# EAGLE design Gvove - Piezo Vibration Sensor v1.1 (EAGLE 6.5.0)

## Sheet 1 of 2
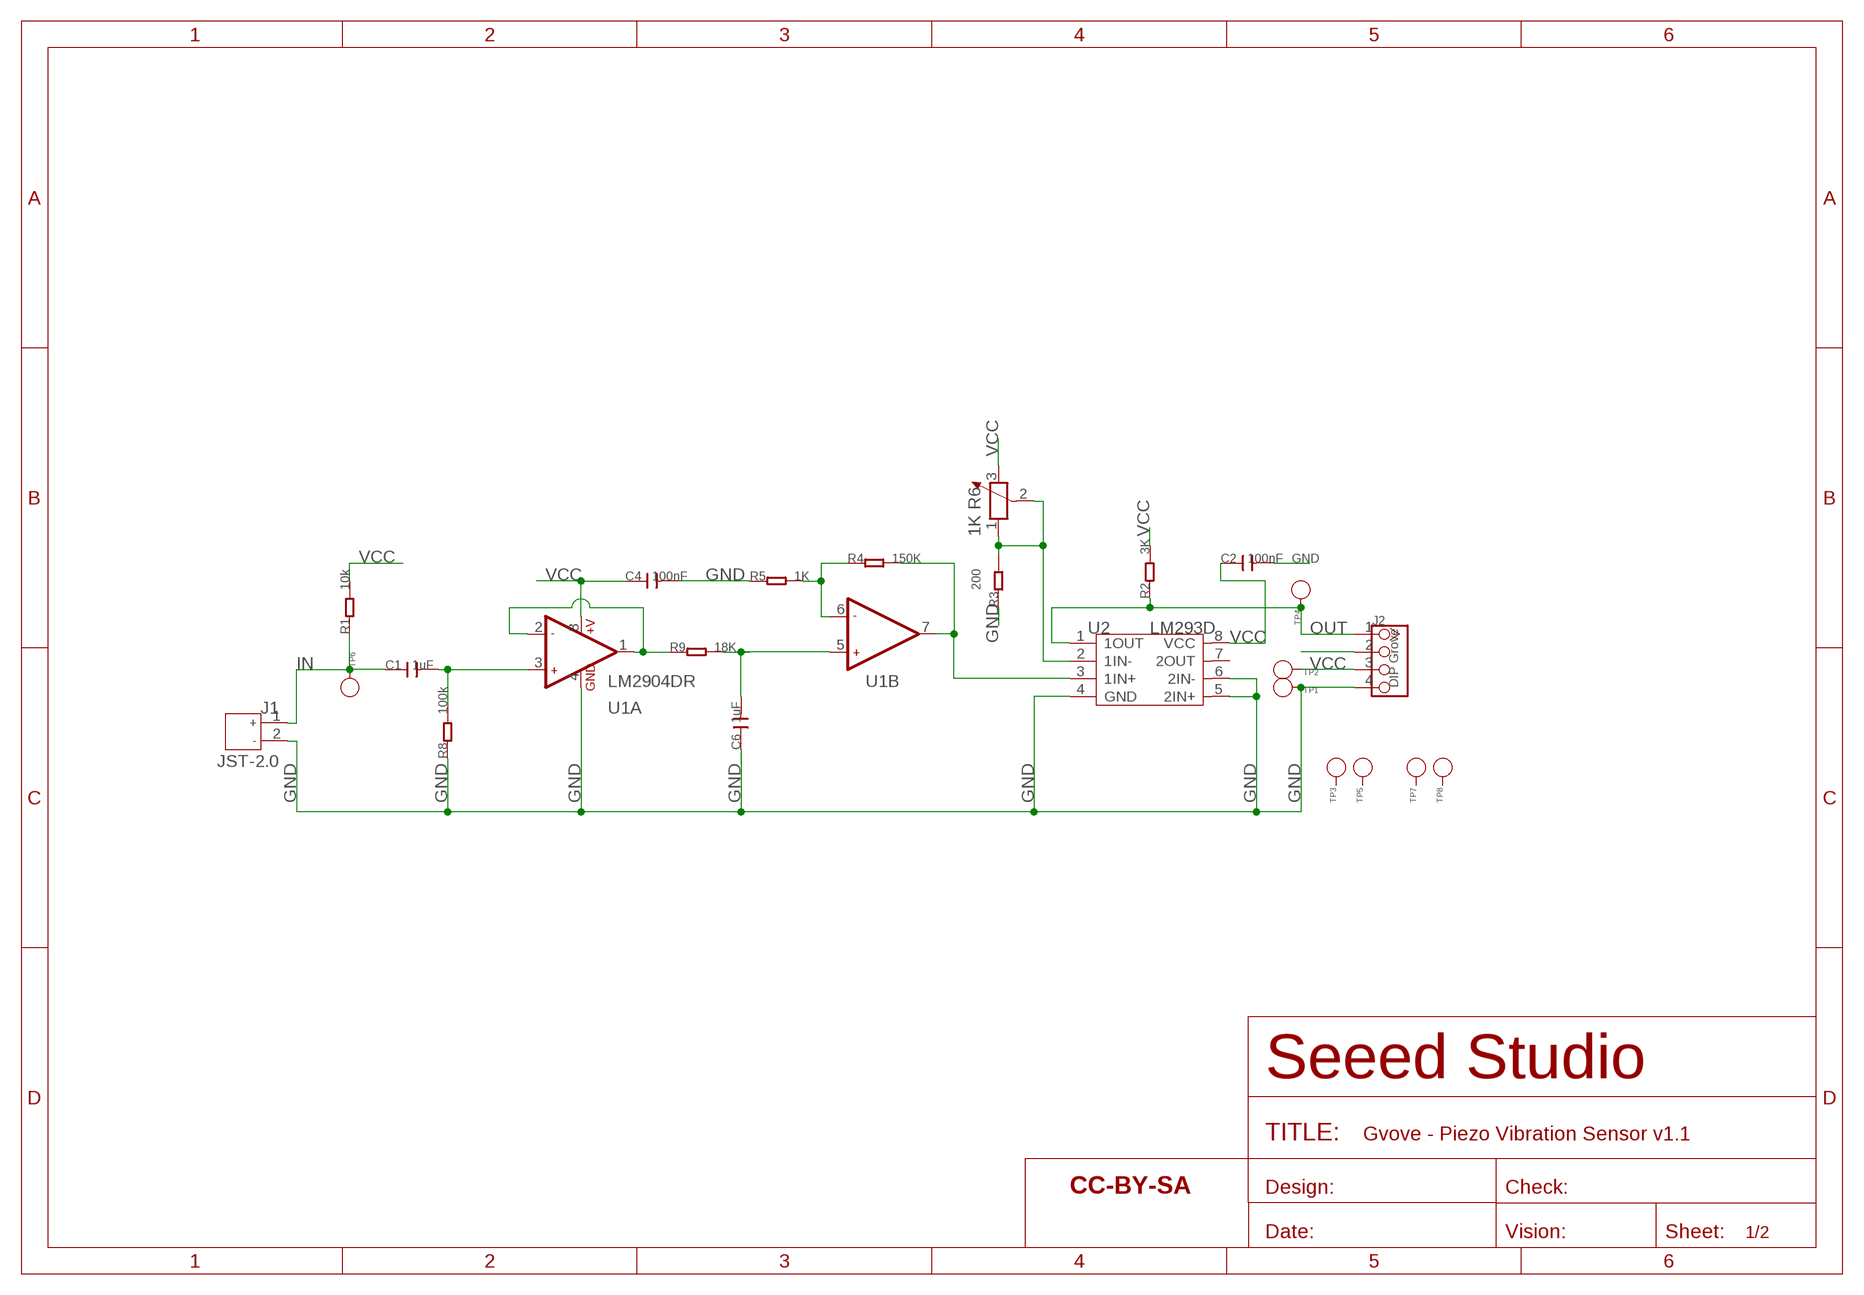
[diagram p0: schematic, sheet 1]

### Parts
C1  1uF  C-0603  [C0603]
C2  100nF  C-0603  [C0603]
C4  100nF  C-0603  [C0603]
C6  1uF  C-0603  [C0603]
J1  JST-2.0  JACK-JST-2P-PW'2.0'  [JST-2.0]
J2  DIP Grove  TWIG-4P-2.0-2.0  [4P-2.0]
R1  10k  R-0603  [R0603]
R2  3K  R-0603  [R0603]
R3  200  R-0603  [R0603]
R4  150K  R-0603  [R0603]
R5  1K  R-0603  [R0603]
R6  1K  R-POTENTIOMETER'RTRIM3214W'  [3P-SMD-SQUA-4.6X3.7]
R8  100k  R-0603  [R0603]
R9  18K  R-0603  [R0603]
TP1  PAD-TEST-POINT'4545'  [TP_4545]
TP2  PAD-TEST-POINT'4545'  [TP_4545]
TP3  PAD-TEST-POINT'4545'  [TP_4545]
TP4  PAD-TEST-POINT'4545'  [TP_4545]
TP5  PAD-TEST-POINT'4545'  [TP_4545]
TP6  PAD-TEST-POINT'4545'  [TP_4545]
TP7  PAD-TEST-POINT'4545'  [TP_4545]
TP8  PAD-TEST-POINT'4545'  [TP_4545]
U1  LM2904DR  LMV358D  [SO08]
U2  LM293D  [SOIC8-6.0]
U$2  SEEEDSTUDIO-OPEN-SCH-FRAME  [SEEEDSTUDIO-PCB-FRAME]

### Nets
GND: C2.2 C4.2 C6.1 J1.2 J2.4 R3.1 R5.1 R8.1 TP1.T U1.4(A:GND) U2.4(GND) U2.5(2IN+) U2.6(2IN-)
IN: C1.1 J1.1 R1.1 TP6.T
N$1: R3.2 R6.1 R6.2 U2.2(1IN-)
N$2: C1.2 R8.2 U1.3(A:+IN1)
N$3: R9.1 U1.1(A:OUT1) U1.2(A:-IN1)
N$4: R4.1 R5.2 U1.6(B:-IN2)
N$5: R4.2 U1.7(B:OUT2) U2.3(1IN+)
N$6: J2.2
N$9: C6.2 R9.2 U1.5(B:+IN2)
OUT: J2.1 R2.1 TP4.T U2.1(1OUT)
VCC: C2.1 C4.1 J2.3 R1.2 R2.2 R6.3 TP2.T U1.8(A:+V) U2.8(VCC)
Unconnected: TP3.T TP5.T TP7.T TP8.T U2.7(2OUT)

## Sheet 2 of 2
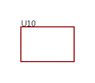
[diagram p1: schematic, sheet 2]

### Parts
U10  TWIG'2U'  [GROVE-TEST-PLATFORM]

## Library data of the parts
C1 C2 C4 C6 = Discrete:C*: Ceramic Capacitors
J1 = Connector:JACK-JST-2P-PW
J2 = Connector:TWIG-4P-2.0
R1-R5 R8 R9 = Discrete:R*
R6 = Discrete:R-POTENTIOMETER*: Potentiometer
TP1-TP8 = Discrete:PAD-TEST-POINT; PARTNO: DNP
U1 = IC:LMV358: General purpose LOW Voltage, Rail-to-Rail Output Amplifiers http://www.fairchildsemi.com/ds/LM/LMV358.pdf
U2 = template:LM293: Dual Differential Comparator
U10 = template:TWIG
U$2 = moudle-new:SEEEDSTUDIO-OPEN-SCH-FRAME

## Board
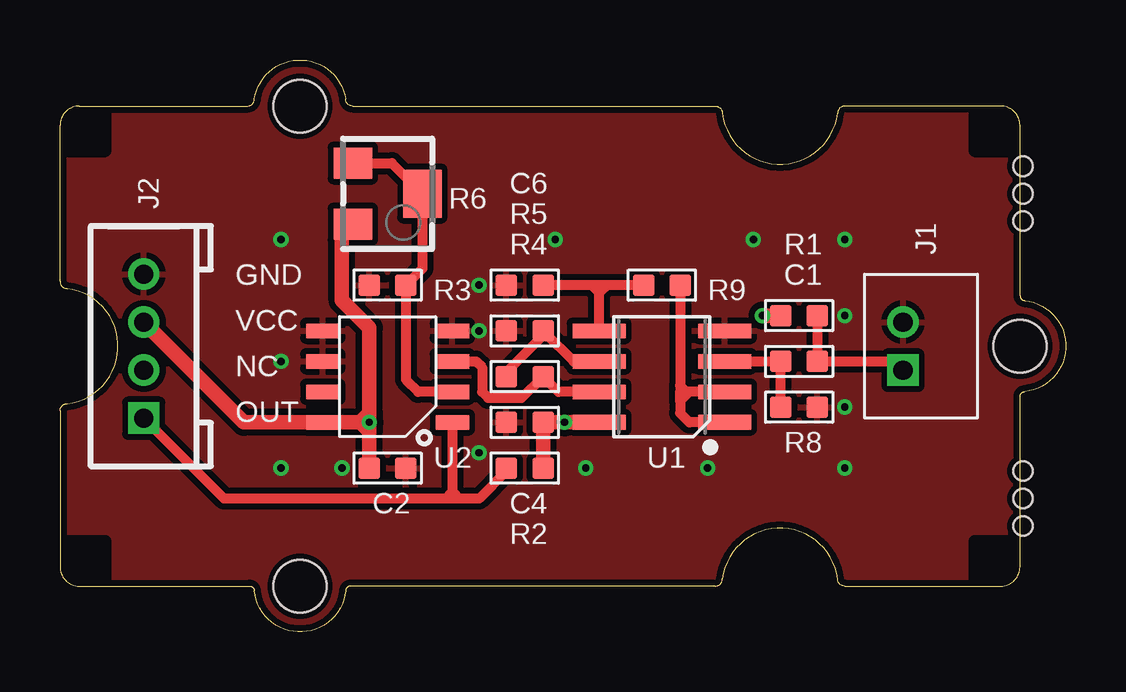
[diagram p2: board, top side]
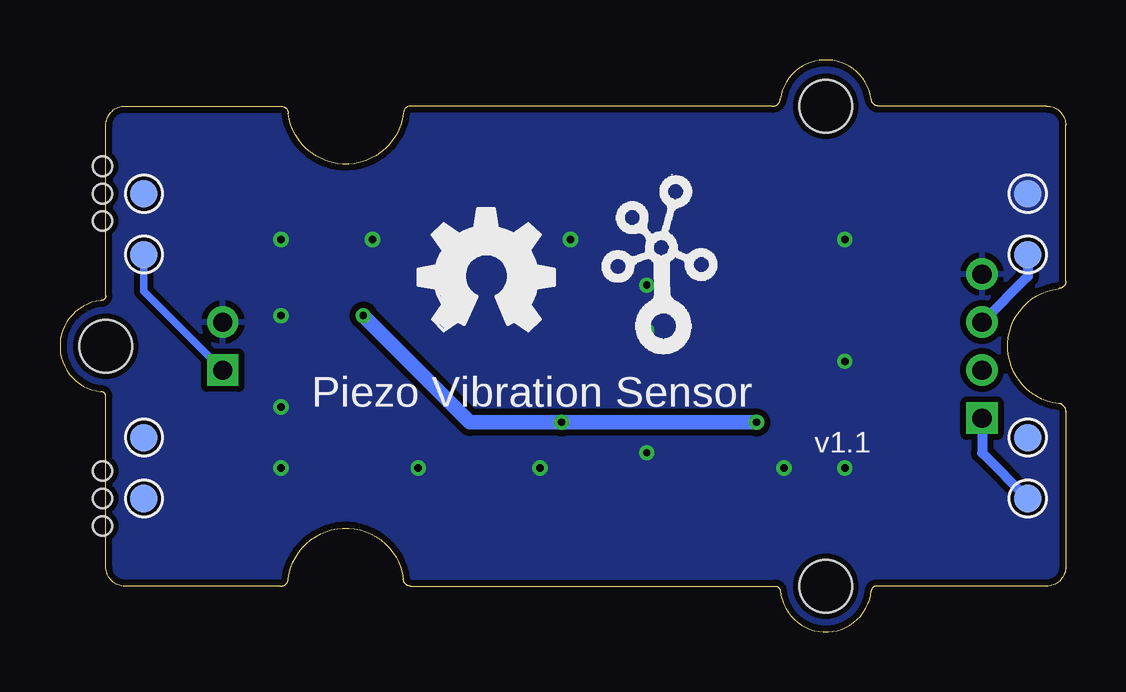
[diagram p3: board, bottom side, seen from below]

Size 41.91 x 23.83 mm. Coordinates in mm from the lower left corner, seen from the top.
Copper layers (1*16): Top 0.035mm / dielectric 1.5mm / Bottom 0.035mm
Design rules "SeeedStudio_2layer_DRU_no_angle_20140221 *": minimum track width 6mil, minimum drill 12mil, track to track 6mil, track to pad 6mil, pad to pad 6mil, via to via 6mil, smd to smd 0mil, copper to edge 10mil, drill to drill 10mil, minimum pad ring 10mil, minimum via ring 6mil, stop-mask expansion 2mil, vias tented up to drill 100mil, thermal gap 10mil
Holes 0.8 mm at 40.13,17.12 40.13,19.4 40.13,18.26 40.13,4.42 40.13,6.7 40.13,5.56

### Footprints (pad centres in the part's own frame; a part is rotated, then mirrored left to right if it is on the bottom)
C0603 = smd 0.889 x 0.889: 1 -0.762,0; 2 0.762,0
JST-2.0 = drill 0.8 pad 1.3 square: 1 -1,0.75 | drill 0.8 pad 1.3: 2 1,0.75
4P-2.0 = drill 0.8 pad 1.27 square: 1 -3,0 | drill 0.8 pad 1.27: 2 -1,0; 3 1,0; 4 3,0
R0603 = smd 0.889 x 0.889: 1 -0.762,0; 2 0.762,0
3P-SMD-SQUA-4.6X3.7 = smd 1.3 x 1.6: 1 -1.275,-1.45; 3 1.275,-1.45 | smd 2 x 1.6: 2 0,1.45
TP_4545 = smd 1.143 x 1.143: T 0,0
SO08 = smd 0.61 x 2.21: 1 -1.905,-2.616; 2 -0.635,-2.616; 3 0.635,-2.616; 4 1.905,-2.616; 5 1.905,2.616; 6 0.635,2.616; 7 -0.635,2.616; 8 -1.905,2.616
SOIC8-6.0 = smd 0.6 x 1.4: 1 -1.905,-2.7; 2 -0.635,-2.7; 3 0.635,-2.7; 4 1.905,-2.7; 5 1.905,2.7; 6 0.635,2.7; 7 -0.635,2.7; 8 -1.905,2.7
GROVE-TEST-PLATFORM = hole 2.2: -10,-10; -10,10; 20,0

### Placement (x,y rotation side)
C1  30.8,11.27 180 top
C2  13.65,6.83 0 top
C4  19.36,8.73 180 top
C6  19.36,14.45 0 top
J1  35.88,11.91 90 top
J2  3.49,11.91 90 top
R1  30.8,13.18 180 top
R2  19.36,6.83 0 top
R3  13.65,14.45 0 top
R4  19.36,10.64 0 top
R5  19.36,12.54 0 top
R6  13.65,18.26 270 top
R8  30.8,9.37 180 top
R9  25.08,14.45 180 top
TP1  1.59,18.26 0 bottom
TP2  1.59,15.72 0 bottom
TP3  1.59,8.1 0 bottom
TP4  1.59,5.56 0 bottom
TP5  38.41,5.56 0 bottom
TP6  38.41,15.72 0 bottom
TP7  38.41,18.26 0 bottom
TP8  38.41,8.1 0 bottom
U1  25.08,10.64 90 top
U2  13.65,10.64 90 top
U10  20,11.91 0 top
U$1  [GROVE-TEST-PLATFORM]  20,11.91 0 top
U$2  -0.34,-10.06 0 top  (outside the outline)
U$3  [TWIGLOGO]  16.82,12.54 0 bottom
U$4  [OSHW_FILLX200_NOTEXT]  26.98,12.54 0 bottom

### Tracks (layer width: path | path; a pad name or v marks a point on that pad's centre or on a via)
GND  (via drill 0.3 pad 0.64)
  other vias: 9.21,11.27 9.21,6.83 11.74,6.83 17.46,7.46 32.7,9.37 17.46,14.45 17.46,12.54 9.21,16.35 20.64,16.35 28.89,16.35 32.7,13.18 32.7,16.35 21.91,6.83 26.98,6.83 32.7,6.83
  pour Top (isolate 0.254): -0.32,23.97 42.23,23.97 42.23,-0.16 -0.32,-0.16
  pour Bottom (isolate 0.254): -0.32,23.97 42.23,23.97 42.23,-0.16 -0.32,-0.16
IN
  Top 0.406: R1.1 C1.1 34.76,11.27 J1.1
  Bottom 0.305: TP6.T 38.41,14.2 J1.1
N$1
  Top 0.406: U2.2 14.92,10 14.41,10.51 R3.2 15.1,15.14 R6.2 13.82,19.53 R6.1
N$2
  Top 0.406: R8.2 30.03,11.02 | 30.03,11.02 C1.2 30.16,11.4 | U1.3 29.78,11.27 30.03,11.02
N$3
  Top 0.406: R9.1 25.84,10.26 | 25.84,10.26 25.84,10 | 25.84,9.62 25.84,9.11 26.22,8.73 U1.1 | U1.2 26.22,10 | 26.1,10 25.84,10 | 26.22,10 26.1,10 | 26.1,10 25.84,10.26 | 26.22,10 25.84,9.62 | 25.84,9.62 25.84,10
N$4
  Top 0.406: U1.6 21.4,11.27 20.22,12.45 | 20.22,12.45 R5.2 | R4.1 18.6,10.83 20.22,12.45
N$5
  Top 0.406: U1.7 20.76,10 R4.2 19.24,9.75 17.84,9.75 17.59,10 17.59,11.02 17.33,11.27 U2.3
N$9
  Top 0.406: R9.2 22.79,14.45 | 22.79,14.45 22.41,14.45 | 22.41,14.45 22.16,14.45 | 22.16,14.45 22.03,14.45 C6.2 | U1.5 22.46,14.4 22.41,14.45 | 22.16,14.45 22.41,14.19 22.54,14.19 22.79,14.45 | 22.41,14.45 22.16,14.45
OUT
  Top 0.406: R2.1 18.6,6.7 17.46,5.56 16.63,5.56 | 16.63,5.56 16.44,5.56 | 16.44,5.56 16.06,5.56 | 16.06,5.56 15.94,5.56 6.84,5.56 J2.1 | U2.1 16.35,5.65 16.44,5.56 | 16.06,5.56 16.32,5.81 16.38,5.81 16.63,5.56 | 16.44,5.56 16.06,5.56
  Bottom 0.406: J2.1 3.49,7.46 TP4.T
VCC  (via drill 0.3 pad 0.64)
  Top 0.61: v12.89,8.73 12.51,8.73 | 12.51,8.73 U2.8 7.66,8.73 J2.3 | 12.2,16.81 R6.3 11.74,16.99 11.74,13.81 12.89,12.67 12.89,9.11 | C2.1 12.89,8.35 | 12.89,8.35 v12.89,8.73 | v12.89,8.73 12.89,9.11 | 12.51,8.73 12.89,9.11 | 12.51,8.73 12.89,8.35 | U1.8 v21.02,8.73 C4.1 R2.2 | v29.27,13.18 R1.2
  Bottom 0.406: TP2.T 1.59,14.81 J2.3
  Bottom 0.61: v12.89,8.73 v21.02,8.73 24.83,8.73 v29.27,13.18

### Text on the board
tPlace: GND | VCC | NC | OUT
bPlace: Piezo Vibration Sensor | v1.1